# Altium schematic sheet [04] MICROCONTROLLER.SchDoc: Template
size A4; Author: Hom; CompanyName: KitSprout; DrawnBy: Hom; Engineer: Hom; Organization: KitSprout; Revision: A; SheetNumber: 4; SheetTotal: 6; Version: 0.0; LibVersion: 0.0
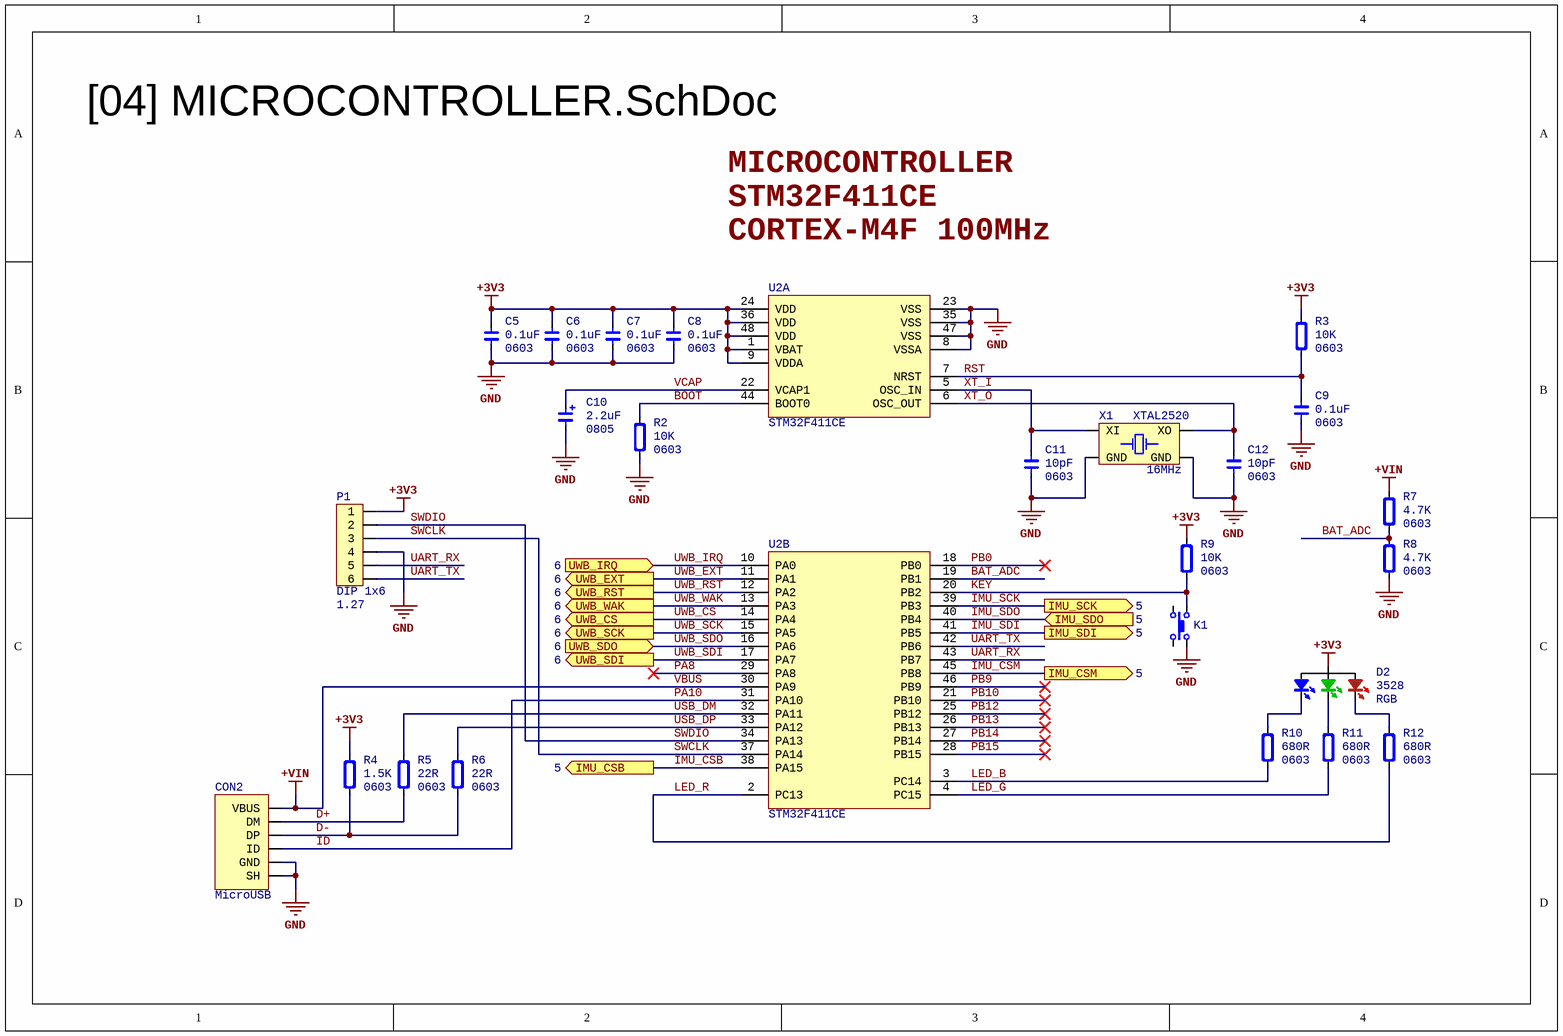
[diagram p0: [04] MICROCONTROLLER.SchDoc]

## Parts
C5  Type: 0603  [CAP_0603]  (hidden comment: 0.1uF)
C6  Type: 0603  [CAP_0603]  (hidden comment: 0.1uF)
C7  Type: 0603  [CAP_0603]  (hidden comment: 0.1uF)
C8  Type: 0603  [CAP_0603]  (hidden comment: 0.1uF)
C9  Type: 0603  [CAP_0603]  (hidden comment: 0.1uF)
C10  Type: 0805  [CAP_TAN_P0805]  (hidden comment: 2.2uF)
C11  Type: 0603  [CAP_0603]  (hidden comment: 10pF)
C12  Type: 0603  [CAP_0603]  (hidden comment: 10pF)
CON2  MicroUSB  [USB_Micro-AB]
D2  Type: 3528  [LED_3528_RGB]  (hidden comment: RGB)
K1  ButtonTACT  [ButtonTACT_3.4*3.5_90]  (value not drawn)
P1  value 1.27  [HDR1X6_1.27_180HF]  (hidden comment: DIP 1x6)
R2  Type: 0603  [RES_0603]  (hidden comment: 10K)
R3  Type: 0603  [RES_0603]  (hidden comment: 10K)
R4  Type: 0603  [RES_0603]  (hidden comment: 1.5K)
R5  Type: 0603  [RES_0603]  (hidden comment: 22R)
R6  Type: 0603  [RES_0603]  (hidden comment: 22R)
R7  Type: 0603  [RES_0603]  (hidden comment: 4.7K)
R8  Type: 0603  [RES_0603]  (hidden comment: 4.7K)
R9  Type: 0603  [RES_0603]  (hidden comment: 10K)
R10  Type: 0603  [RES_0603]  (hidden comment: 680R)
R11  Type: 0603  [RES_0603]  (hidden comment: 680R)
R12  Type: 0603  [RES_0603]  (hidden comment: 680R)
U2  STM32F411CE  [QFN_P0.5_48]  (parts A,B of 2)
X1  Type: XTAL2520  [XT_2520_4]  (hidden comment: 16MHz)

## Ports
IMU_CSB (out, see 5), IMU_CSM (out, see 5), IMU_SCK (out, see 5), IMU_SDI (out, see 5), IMU_SDO (in, see 5), UWB_CS (out, see 6), UWB_EXT (out, see 6), UWB_IRQ (in, see 6), UWB_RST (out, see 6), UWB_SCK (out, see 6), UWB_SDI (out, see 6), UWB_SDO (in, see 6), UWB_WAK (out, see 6)

## Nets
+3V3: C5.2 C6.2 C7.2 C8.2 D2.4(A) P1.1 R3.2 R4.2 R9.2 U2.1(VBAT) U2.9(VDDA) U2.24(VDD) U2.36(VDD) U2.48(VDD)
+VIN: CON2.1(VBUS) R7.2 U2.30(PA9)
GND: C5.1 C6.1 C7.1 C8.1 C9.1 C10.2 C11.1 C12.1 CON2.0(SH) CON2.5(GND) K1.2 P1.4 R2.1 R8.1 U2.8(VSSA) U2.23(VSS) U2.35(VSS) U2.47(VSS) X1.2(GND) X1.4(GND)
BAT_ADC: R7.1 R8.2 U2.19(PB1)
BOOT: R2.2 U2.44(BOOT0)
D+: CON2.2(DM) R5.1
D-: CON2.3(DP) R4.1 R6.1
ID: CON2.4(ID) U2.31(PA10)  [also labelled PA10]
IMU_CSB: U2.38(PA15) ; port IMU_CSB
IMU_CSM: U2.45(PB8) ; port IMU_CSM
IMU_SCK: U2.39(PB3) ; port IMU_SCK
IMU_SDI: U2.41(PB5) ; port IMU_SDI
IMU_SDO: U2.40(PB4) ; port IMU_SDO
KEY: K1.1 R9.1 U2.20(PB2)
LED_B: R10.1 U2.3(PC14)
LED_G: R11.1 U2.4(PC15)
LED_R: R12.1 U2.2(PC13)
PA8: U2.29(PA8)
PB0: U2.18(PB0)
PB9: U2.46(PB9)
PB10: U2.21(PB10)
PB12: U2.25(PB12)
PB13: U2.26(PB13)
PB14: U2.27(PB14)
PB15: U2.28(PB15)
RST: C9.2 R3.1 U2.7(NRST)
SWCLK: P1.3 U2.37(PA14)
SWDIO: P1.2 U2.34(PA13)
UART_RX: P1.5 U2.43(PB7)
UART_TX: P1.6 U2.42(PB6)
USB_DM: R5.2 U2.32(PA11)
USB_DP: R6.2 U2.33(PA12)
UWB_CS: U2.14(PA4) ; port UWB_CS
UWB_EXT: U2.11(PA1) ; port UWB_EXT
UWB_IRQ: U2.10(PA0) ; port UWB_IRQ
UWB_RST: U2.12(PA2) ; port UWB_RST
UWB_SCK: U2.15(PA5) ; port UWB_SCK
UWB_SDI: U2.17(PA7) ; port UWB_SDI
UWB_SDO: U2.16(PA6) ; port UWB_SDO
UWB_WAK: U2.13(PA3) ; port UWB_WAK
VCAP: C10.1 U2.22(VCAP1)
XT_I: C11.2 U2.5(OSC_IN) X1.1(XI)
XT_O: C12.2 U2.6(OSC_OUT) X1.3(XO)
NetD2_1: D2.1(R) R12.2
NetD2_2: D2.2(G) R11.2
NetD2_3: D2.3(B) R10.2

Not connected (* = marked no-connect by the designer): K1 3 4

## Notes on the sheet
- MICROCONTROLLER
- STM32F411CE
- CORTEX-M4F 100MHz
- VBUS

## Library data of the parts
C5-C9 C11 C12 = Cap_0603: Capacitor
  C5-C9: Value: 0.1uF
  C11 C12: Value: 10pF
C10 = Cap_Tan_0805: Capacitor Tantalum; Value: 2.2uF
CON2 = USB_Micro: USB
D2 = LED_3528_RGB: LED; Value: RGB
K1 = ButtonTACT: Button; Value: ButtonTACT
P1 = HDR1x6_1.27T: Header; Type: DIP 1x6
R2-R12 = Res_0603: Resistor
  R2 R3 R9: Value: 10K
  R4: Value: 1.5K
  R5 R6: Value: 22R
  R7 R8: Value: 4.7K
  R10-R12: Value: 680R
U2 = STM32F4x1C: MCU; Type: QFN48 P0.5
X1 = XTAL_2520_4P: Crystal Oscillator; Value: 16MHz